# EAGLE design 1P3W (EAGLE 9.6.2)
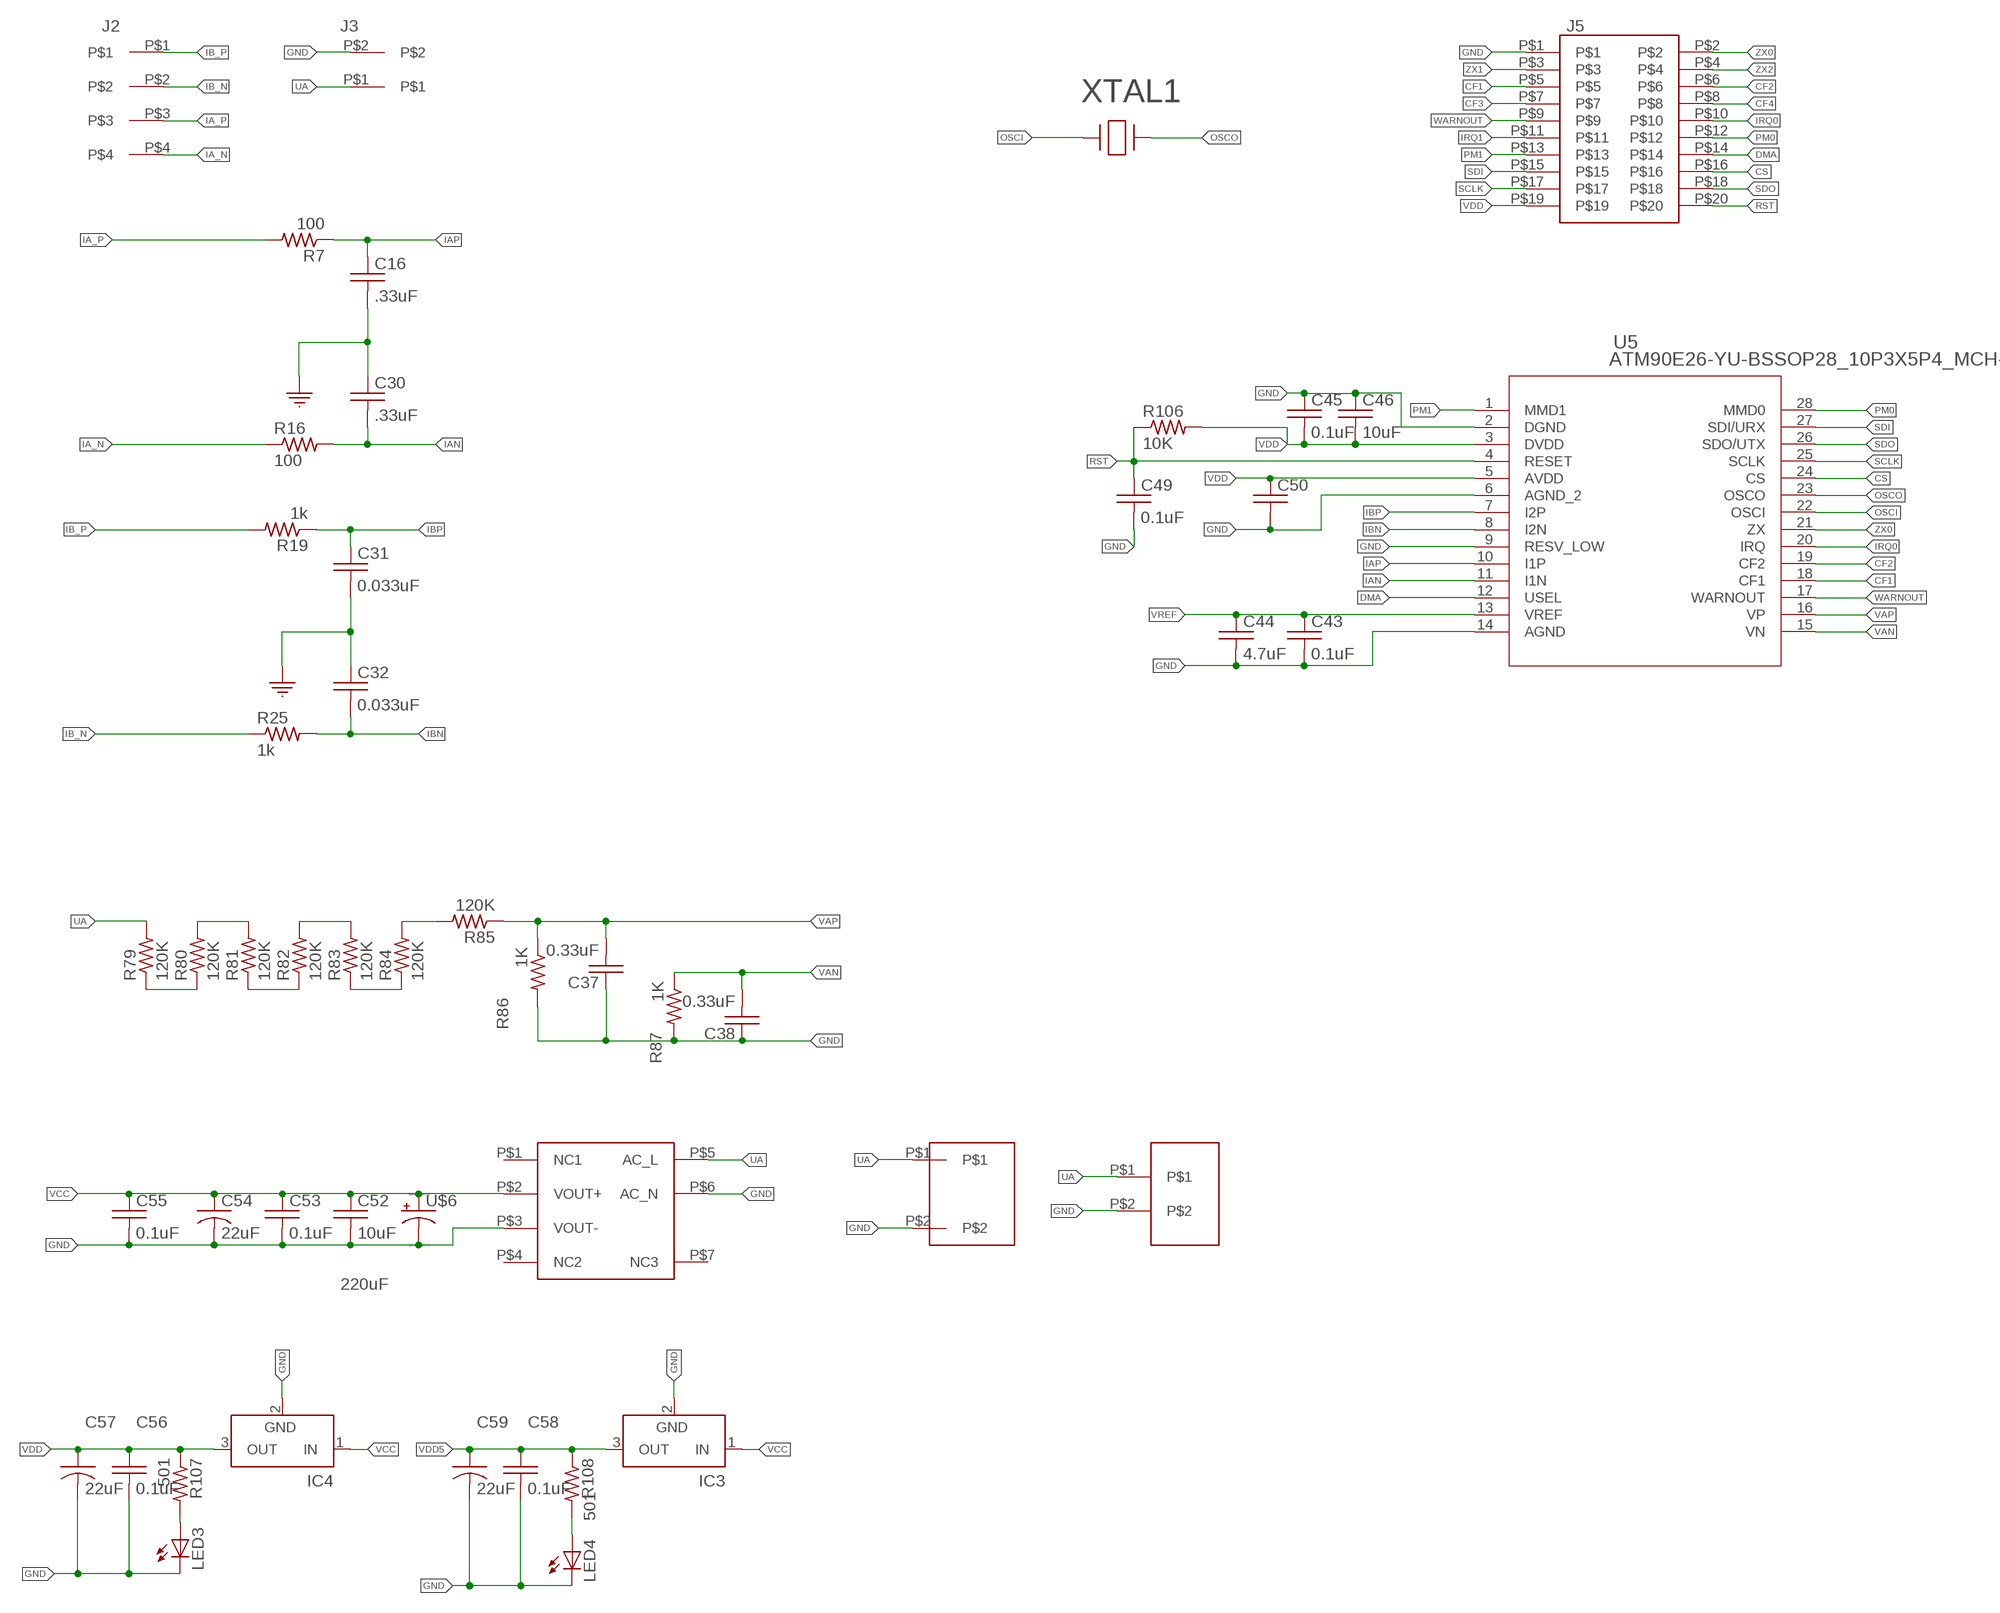
[diagram p0: schematic, sheet 1]

## Parts
C16  .33uF  C_0402  [0402]
C30  .33uF  C_0402  [0402]
C31  0.033uF  C_0402  [0402]
C32  0.033uF  C_0402  [0402]
C37  0.33uF  C_0402  [0402]
C38  0.33uF  C_0402  [0402]
C43  0.1uF  C_0402  [0402]
C44  4.7uF  C_0402  [0402]
C45  0.1uF  C_0402  [0402]
C46  10uF  C_0402  [0402]
C49  0.1uF  C_0402  [0402]
C50  C_0402  [0402]
C51  CAP_THIN_FILM_TDK_32922CAP  [CAP_THIN_FILM_32922]
C52  10uF  C_0402  [0402]
C53  0.1uF  C_0402  [0402]
C54  22uF  C-USC1206  [C1206]
C55  0.1uF  C_0402  [0402]
C56  0.1uF  C_0402  [0402]
C57  22uF  C-USC1206  [C1206]
C58  0.1uF  C_0402  [0402]
C59  22uF  C-USC1206  [C1206]
IC3  LT1129CST5  [SOT223]
IC4  LT1129CST3  [SOT223]
J2  3.81MM_1_X_4_RT_ANGLE_PLUG_HEADER  [1X4_3.81MM_PITCH]
J3  3.81MM_1_X_2_RT_ANGLE_PLUG_HEADER  [2_3.81MM_PITCH]
J5  2_X_10_HEADER_GENERIC  [2_X_10_.1_INCH]
LED3  LED_0805_GREEN  [LED_0805_GREEN]
LED4  LED_0805_GREEN  [LED_0805_GREEN]
R7  100  R_0402  [0402]
R16  100  R_0402  [0402]
R19  1k  R_0402  [0402]
R25  1k  R_0402  [0402]
R79  120K  R_0402  [0402]
R80  120K  R_0402  [0402]
R81  120K  R_0402  [0402]
R82  120K  R_0402  [0402]
R83  120K  R_0402  [0402]
R84  120K  R_0402  [0402]
R85  120K  R_0402  [0402]
R86  1K  R_0402  [0402]
R87  1K  R_0402  [0402]
R106  10K  R_0402  [0402]
R107  501  R_0402  [0402]
R108  501  R_0402  [0402]
U4  TMLM_04109  [TMLM04]
U5  ATM90E26-YU-BSSOP28_10P3X5P4_MCH-M  [SSOP28_10P3X5P4_MCH-M]
U$5  VAR_10MM_VDRUS10  [VAR_10MM_VDRUS10]
U$6  220uF  C_AL_ELECTROLYTIC_SMD_220UF  [C_AL_ELECTROLYTIC_SMD_220UF]
XTAL1  ABLS-8.192MHZ-B2-TXTAL_HC/49US_ABLS_ABR-M  [XTAL_HC/49US_ABLS_ABR-M]

## Nets
CF1: J5.P$5 U5.18(CF1)
CF2: J5.P$6 U5.19(CF2)
CF3: J5.P$7
CF4: J5.P$8
CS: J5.P$16 U5.24(CS)
DMA: J5.P$14 U5.12(USEL)
GND: C16.P$2 C30.P$1 C31.P$2 C32.P$1 C37.P$1 C38.P$1 C43.P$2 C44.P$2 C45.P$1 C46.P$1 C49.P$2 C50.P$2 C51.P$2 C52.P$2 C53.P$2 C54.2 C55.P$2 C56.P$2 C57.2 C58.P$2 C59.2 IC3.2(GND) IC4.2(GND) J3.P$2 J5.P$1 LED3.C LED4.C R86.P$2 R87.P$2 U4.P$3(VOUT-) U4.P$6(AC_N) U5.2(DGND) U5.6(AGND_2) U5.9(RESV_LOW) U5.14(AGND) U$5.P$2 U$6.N-(-)
IA_N: J2.P$4 R16.P$1
IA_P: J2.P$3 R7.P$2
IAN: C30.P$2 R16.P$2 U5.11(I1N)
IAP: C16.P$1 R7.P$1 U5.10(I1P)
IB_N: J2.P$2 R25.P$1
IB_P: J2.P$1 R19.P$2
IBN: C32.P$2 R25.P$2 U5.8(I2N)
IBP: C31.P$1 R19.P$1 U5.7(I2P)
IRQ0: J5.P$10 U5.20(IRQ)
IRQ1: J5.P$11
N$37: R79.P$1 R80.P$1
N$38: R80.P$2 R81.P$2
N$39: R81.P$1 R82.P$1
N$40: R82.P$2 R83.P$2
N$41: R83.P$1 R84.P$1
N$42: R84.P$2 R85.P$2
N$55: LED3.A R107.P$2
N$56: LED4.A R108.P$2
OSCI: U5.22(OSCI) XTAL1.1
OSCO: U5.23(OSCO) XTAL1.2
PM0: J5.P$12 U5.28(MMD0)
PM1: J5.P$13 U5.1(MMD1)
RST: C49.P$1 J5.P$20 R106.P$1 U5.4(RESET)
SCLK: J5.P$17 U5.25(SCLK)
SDI: J5.P$15 U5.27(SDI/URX)
SDO: J5.P$18 U5.26(SDO/UTX)
UA: C51.P$1 J3.P$1 R79.P$2 U4.P$5(AC_L) U$5.P$1
VAN: C38.P$2 R87.P$1 U5.15(VN)
VAP: C37.P$2 R85.P$1 R86.P$1 U5.16(VP)
VCC: C52.P$1 C53.P$1 C54.1 C55.P$1 IC3.1(IN) IC4.1(IN) U4.P$2(VOUT+) U$6.P+(+)
VDD: C45.P$2 C46.P$2 C50.P$1 C56.P$1 C57.1 IC4.3(OUT) J5.P$19 R106.P$2 R107.P$1 U5.3(DVDD) U5.5(AVDD)
VDD5: C58.P$1 C59.1 IC3.3(OUT) R108.P$1
VREF: C43.P$1 C44.P$1 U5.13(VREF)
WARNOUT: J5.P$9 U5.17(WARNOUT)
ZX0: J5.P$2 U5.21(ZX)
ZX1: J5.P$3
ZX2: J5.P$4
Unconnected: U4.P$1(NC1) U4.P$4(NC2) U4.P$7(NC3)

## Power pins joined to a net without a drawn wire
GND: IC3.4(GND) IC4.4(GND)

## Library data of the parts
C16 C30-C32 C37 C38 C43-C46 C49 C50 C52 C53 C55 C56 C58 = 3D_MIG_Controller:C_0402
C51 = 3D_MIG_Controller:CAP_THIN_FILM_TDK_32922
C54 C57 C59 = 3D_MIG_Controller:C-US: CAPACITOR, American symbol
IC3 = 3D_MIG_Controller:LT1129CST5: VOLTAGE REGULATOR with shutdown; MPN: LT1129CST-5#PBF; OC_FARNELL: 1663375; OC_NEWARK: 57M2069
IC4 = 3D_MIG_Controller:LT1129CST3: VOLTAGE REGULATOR with shutdown; MPN: LT1129CST-5#PBF; OC_FARNELL: 1663375; OC_NEWARK: 57M2069
J2 = 3D_MIG_Controller:3.81MM_1_X_4_RT_ANGLE_PLUG_HEADER
J3 = 3D_MIG_Controller:3.81MM_1_X_2_RT_ANGLE_PLUG_HEADER
J5 = 3D_MIG_Controller:2_X_10_HEADER_GENERIC
LED3 LED4 = 3D_MIG_Controller:LED_0805_GREEN
R7 R16 R19 R25 R79-R87 R106-R108 = 3D_MIG_Controller:R_0402
U4 = 3D_MIG_Controller:TMLM_04109
U5 = 3D_MIG_Controller:ATM90E26-YU-B; BUILT_BY: EMA_Molly; COPYRIGHT: Copyright (C) 2018 Accelerated Designs. All rights reserved; MANUFACTURER_PART_NUMBER: ATM90E26-YU-B; SOURCELIBRARY: Microchip_2019-08-23_24; VENDOR: Microchip
U$5 = 3D_MIG_Controller:VAR_10MM_VDRUS10
U$6 = 3D_MIG_Controller:C_AL_ELECTROLYTIC_SMD_220UF
XTAL1 = 3D_MIG_Controller:ABLS-8.192MHZ-B2-T; BUILT_BY: EMA_Cory; COPYRIGHT: Copyright (C) 2018 Accelerated Designs. All rights reserved; DATASHEET: https://abracon.com/Resonators/abls.pdf; MANUFACTURER_PART_NUMBER: ABLS-8.192MHZ-B2-T; SOURCELIBRARY: Abracon_2020-04-08; VENDOR: Abracon

## Board
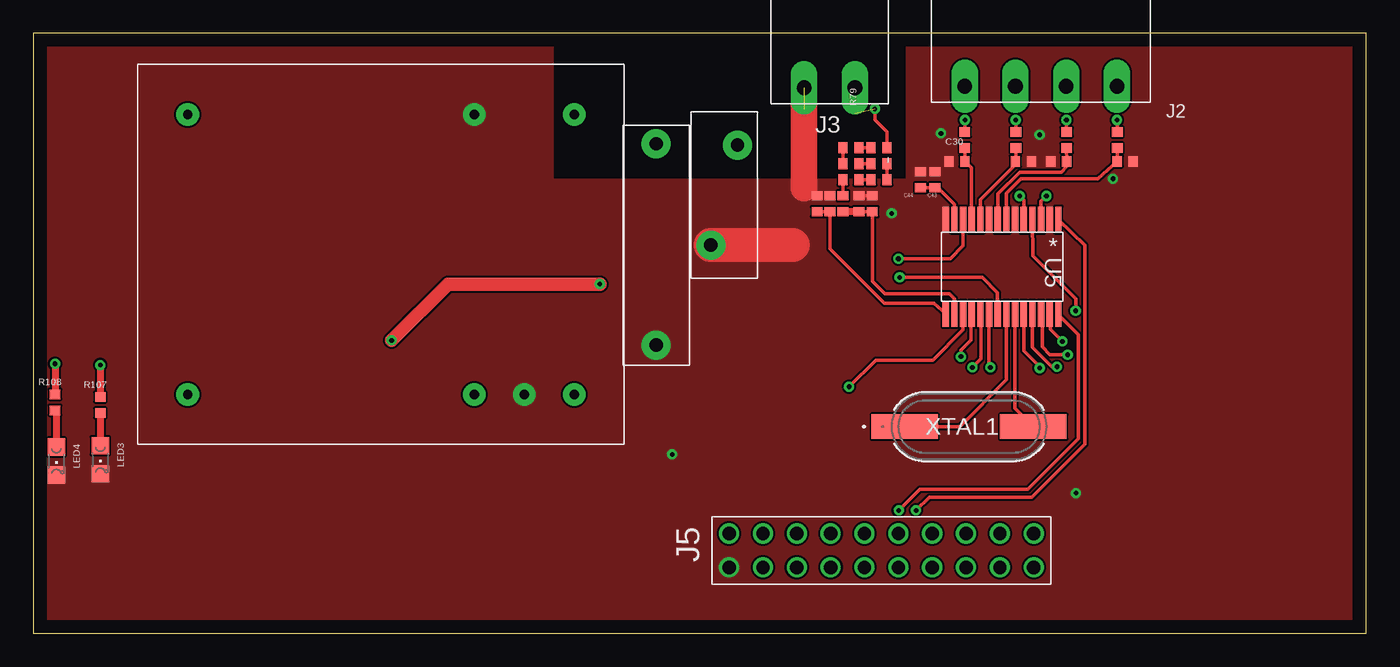
[diagram p1: board, top side]
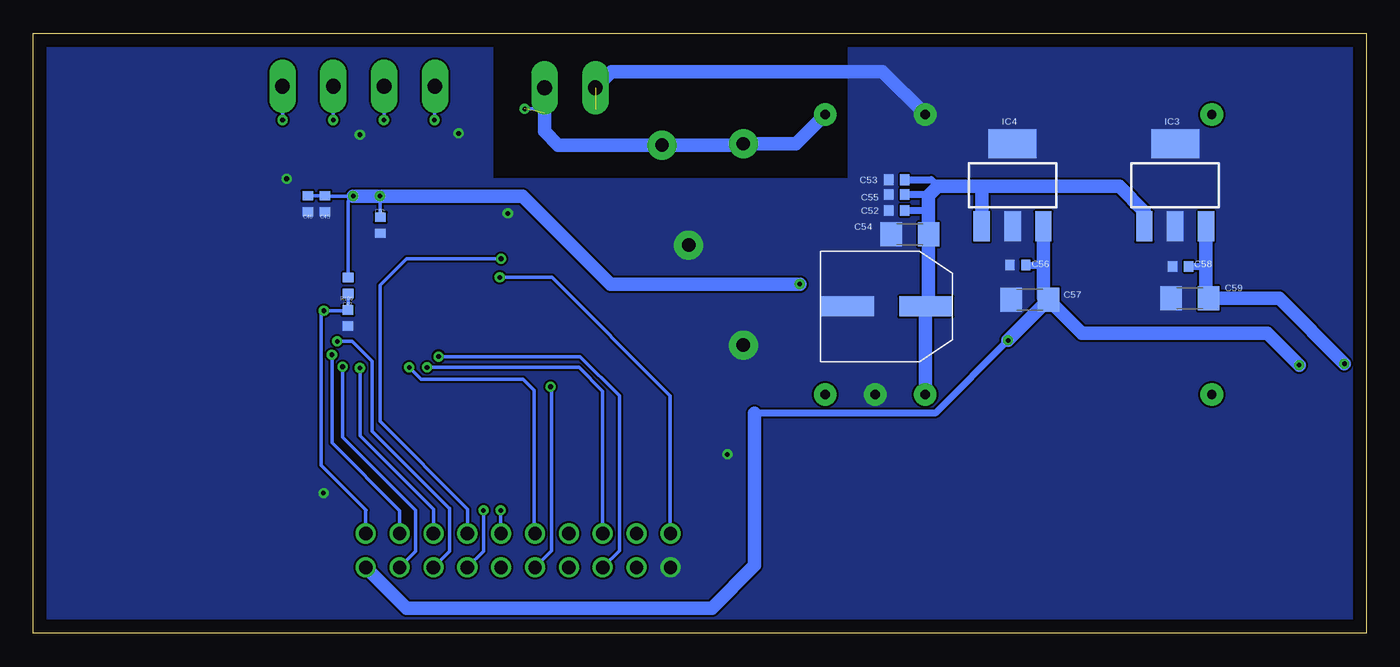
[diagram p2: board, bottom side, seen from below]

Size 100 x 45 mm. Coordinates in mm from the lower left corner, seen from the top.
Outline: 0,0 100,0 100,45 0,45 0,0
Copper layers (1*16): Top 0.035mm / dielectric 1.5mm / Bottom 0.035mm
Design rules "default": minimum track width 6mil, minimum drill 0.35mm, track to track 6mil, track to pad 6mil, pad to pad 6mil, via to via 6mil, smd to smd 6mil, copper to edge 40mil, drill to drill 6mil, minimum pad ring 10mil, minimum via ring 8mil, stop-mask expansion 4mil, vias tented up to drill 0mil, thermal gap 10mil

### Footprints (pad centres in the part's own frame; a part is rotated, then mirrored left to right if it is on the bottom)
0402 = smd 0.8 x 0.7: P$1 0,0.6; P$2 0,-0.6
CAP_THIN_FILM_32922 = drill 1 pad 2.184: P$1 -0.1,0; P$2 15,0
C1206 = smd 1.6 x 1.8: 1 -1.4,0; 2 1.4,0
SOT223 = smd 1.219 x 2.235: 1 -2.311,-3.099; 2 0,-3.099; 3 2.311,-3.099 | smd 3.6 x 2.2: 4 0,3.099
1X4_3.81MM_PITCH = drill 1.1 pad 2 long: P$1 0,0; P$2 3.81,0; P$3 7.62,0; P$4 11.43,0
2_3.81MM_PITCH = drill 1.1 pad 2 long: P$1 0,0; P$2 3.81,0
2_X_10_.1_INCH = drill 1: P$1 -11.43,-1.27; P$2 -11.43,1.27; P$3 -8.89,-1.27; P$4 -8.89,1.27; P$5 -6.35,-1.27; P$6 -6.35,1.27; P$7 -3.81,-1.27; P$8 -3.81,1.27; P$9 -1.27,-1.27; P$10 -1.27,1.27; P$11 1.27,-1.27; P$12 1.27,1.27; P$13 3.81,-1.27; P$14 3.81,1.27; P$15 6.35,-1.27; P$16 6.35,1.27; P$17 8.89,-1.27; P$18 8.89,1.27; P$19 11.43,-1.27; P$20 11.43,1.27
LED_0805_GREEN = smd 1.3 x 1.3: A 0,-1.05; C 0,1.05
TMLM04 = drill 0.7 pad 1.7: P$1 21,-25.25; P$2 21,-3.75; P$3 21,0; P$4 21,3.75; P$5 0,3.75; P$6 0,-3.75; P$7 0,-25.25
SSOP28_10P3X5P4_MCH-M = smd 1.956 x 0.483: 1 -3.531,4.225; 2 -3.531,3.575; 3 -3.531,2.925; 4 -3.531,2.275; 5 -3.531,1.625; 6 -3.531,0.975; 7 -3.531,0.325; 8 -3.531,-0.325; 9 -3.531,-0.975; 10 -3.531,-1.625; 11 -3.531,-2.275; 12 -3.531,-2.925; 13 -3.531,-3.575; 14 -3.531,-4.225; 15 3.531,-4.225; 16 3.531,-3.575; 17 3.531,-2.925; 18 3.531,-2.275; 19 3.531,-1.625; 20 3.531,-0.975; 21 3.531,-0.325; 22 3.531,0.325; 23 3.531,0.975; 24 3.531,1.625; 25 3.531,2.275; 26 3.531,2.925; 27 3.531,3.575; 28 3.531,4.225
VAR_10MM_VDRUS10 = drill 1 pad 2.184: P$1 0,1; P$2 7.5,-1
C_AL_ELECTROLYTIC_SMD_220UF = smd 1.5 x 4: N- 0,2; P+ 0,7.9
XTAL_HC/49US_ABLS_ABR-M = smd 4.978 x 1.829: 1 -4.826,0; 2 4.826,0

### Placement (x,y rotation side)
C16  74.29,35.4 90 top
C30  69.3,35.4 90 top
C31  81.92,35.4 90 top
C32  76.92,35.4 90 top
C37  62.94,32.22 0 top
C38  58.81,32.22 0 top
C43  67.64,34.02 180 top
C44  66.56,34.02 180 top
C45  78.13,32.22 180 bottom
C46  79.41,32.22 180 bottom
C49  76.4,23.64 0 bottom
C50  73.97,30.6 0 bottom
C51  46.73,36.62 270 top
C52  35.23,31.72 270 bottom
C53  35.23,34.02 270 bottom
C54  34.23,29.92 180 bottom
C55  35.23,32.92 270 bottom
C56  26.13,27.62 270 bottom
C57  25.23,25.02 180 bottom
C58  13.93,27.52 270 bottom
C59  13.23,25.12 180 bottom
IC3  14.33,33.62 0 bottom
IC4  26.53,33.62 0 bottom
J2  81.31,41.03 180 top
J3  61.64,40.92 180 top
J5  63.63,6.22 0 top
LED3  5.03,13.02 180 top
LED4  1.73,12.92 180 top
R7  73.72,37 180 top
R16  69.89,37 0 top
R19  81.33,37 180 top
R25  77.52,37 0 top
R79  63.44,36.42 90 top
R80  61.34,36.42 270 top
R81  61.34,35.22 270 top
R82  63.44,35.22 90 top
R83  63.44,34.02 90 top
R84  61.34,34.02 270 top
R85  60.74,32.22 180 top
R86  61.94,32.22 180 top
R87  59.77,32.22 180 top
R106  76.38,26.09 180 bottom
R107  5.03,17.12 0 top
R108  1.63,17.32 0 top
U4  36.83,38.92 270 top
U5  72.68,27.49 270 top
U$5  51.83,36.62 270 top
U$6  40.93,24.52 270 bottom
XTAL1  70.2,15.5 0 top

### Tracks (layer width: path | path; a pad name or v marks a point on that pad's centre or on a via)
CF1  (via drill 0.35)
  Top 0.254: v69.6,20.76 69.6,21.23 70.36,21.98 70.36,23.91 U5.18
  Bottom 0.254: J5.P$5 56.03,6.2 56.03,17.82 58.97,20.76 v69.6,20.76
CF2  (via drill 0.35)
  Top 0.254: U5.19 71.09,23.93 71.09,20.59 v70.45,19.95
  Bottom 0.254: v70.45,19.95 59.06,19.95 57.28,18.17 J5.P$6
CF4
  Bottom 0.254: J5.P$8
CS  (via drill 0.35)
  Top 0.254: v75.5,19.9 75.5,20 74.31,21.2 U5.24
  Bottom 0.254: J5.P$16 69.98,9.3 75.5,14.82 v75.5,19.9
DMA  (via drill 0.35)
  Top 0.254: v64.9,28.1 68.8,28.1 69.75,29.05 U5.12
  Bottom 0.254: J5.P$14 67.43,9.22 67.43,9.32 74,15.89 74,26.1 72,28.1 v64.9,28.1
GND  (via drill 0.35)  (1 unrouted)
  Top 0.254: R86.P$2 C37.P$1 | 58.04,39.1 57.83,39.31
  Top 2: J3.P$2 57.83,33.39
  Top 2.54: 56.99,29.12 U$5.P$2
  Bottom 1.016: U4.P$6 36.28,42.12 56.63,42.12 J3.P$2
  other vias: 78.23,10.52 47.93,13.42 64.4,31.5 68.1,37.5 75.5,37.4 81,34.1
  pour Top (no thermals): 0,45 39,45 39,34.1 65.5,34.1 65.5,45 100,45 100,0 0,0
  pour Bottom (no thermals): 0,45 38.9,45 38.9,34.1 65.5,34.1 65.5,45 100,45 100,0 0,0
IA_N  (via drill 0.35)
  Top 0.254: R16.P$1 69.89,38.59 v69.9,38.5
  Bottom 0.254: v69.9,38.5 69.9,41.01 J2.P$4
IA_P  (via drill 0.35)
  Top 0.254: R7.P$2 73.72,38.48 v73.7,38.5
  Bottom 0.254: v73.7,38.5 J2.P$3
IAN
  Top 0.254: R16.P$2 69.89,35.31 C30.P$2 69.91,35.4 70.4,34.91 U5.11
IAP
  Top 0.254: R7.P$1 73.72,35.66 C16.P$1 73.69,35.15 71.06,32.52 U5.10
IB_N  (via drill 0.35)
  Top 0.254: R25.P$1 77.52,38.58 v77.5,38.5
  Bottom 0.254: v77.5,38.5 J2.P$2
IB_P  (via drill 0.35)
  Top 0.254: R19.P$2 81.33,38.47 v81.3,38.5
  Bottom 0.254: v81.3,38.5 J2.P$1
IBN
  Top 0.254: R25.P$2 77.53,35.42 C32.P$2 77.52,35 77.12,34.6 74,34.6 72.35,32.95 U5.8
IBP
  Top 0.254: R19.P$1 81.32,35.61 C31.P$1 79.85,34.09 74.1,34.09 73.01,33 U5.7
IRQ0  (via drill 0.35)
  Top 0.254: U5.20 71.69,20.06 v71.8,19.94
  Bottom 0.254: J5.P$10 62.43,7.56 62.43,18.22 63.25,19.04 70.9,19.04 v71.8,19.94
N$37
  Top 0.254: R80.P$1 R79.P$1
N$38
  Top 0.254: R81.P$2 R80.P$2
N$39
  Top 0.254: R82.P$1 R81.P$1
N$40
  Top 0.254: R83.P$2 R82.P$2
N$41
  Top 0.254: R84.P$1 R83.P$1
N$42
  Top 0.254: R85.P$2 R84.P$2
N$55
  Top 0.508: R107.P$2 LED3.A
N$56
  Top 0.508: R108.P$2 1.73,16.62 LED4.A
OSCI
  Top 0.254: U5.22 73.01,19.01 69.5,15.5 XTAL1.1
OSCO
  Top 0.254: U5.23 73.66,16.87 XTAL1.2
PM0  (via drill 0.35)
  Top 0.254: U5.28 76.97,23.83 78.4,22.4 78.4,14.6 74.62,10.82 66.53,10.82 v64.93,9.22
  Bottom 0.254: v64.93,9.22 64.93,7.52 J5.P$12
PM1  (via drill 0.35)
  Top 0.254: U5.1 78.9,29.09 78.9,14.2 74.92,10.22 67.23,10.22 v66.23,9.22
  Bottom 0.254: v66.23,9.22 66.23,6.16 J5.P$13
RST  (via drill 0.35)
  Top 0.254: v78.2,24.2 78.2,25.1 74.99,28.31 U5.4
  Bottom 0.254: J5.P$20 75.06,9.19 75.03,9.22 78.4,12.59 78.4,24 v78.2,24.2 76.44,24.2 C49.P$1 76.4,25.48 R106.P$1
SCLK  (via drill 0.35)
  Top 0.254: U5.25 74.95,21.45 76.4,20 v76.8,20
  Bottom 0.254: J5.P$17 71.32,6.15 71.32,9.22 76.8,14.7 v76.8,20
SDI  (via drill 0.35)
  Top 0.254: U5.27 76.31,22.79 v77.2,21.9
  Bottom 0.254: J5.P$15 68.78,6.15 68.78,9.37 68.8,9.37 74.59,15.17 74.59,20.39 76.1,21.9 v77.2,21.9
SDO  (via drill 0.35)
  Top 0.254: U5.26 75.69,23.92 75.69,21.48 76.27,20.9 v77.6,20.9
  Bottom 0.254: J5.P$18 72.52,9.2 77.6,14.28 v77.6,20.9
UA  (via drill 0.35)  (1 unrouted)
  Top 0.254: R79.P$2 64.04,37.62 63.13,38.53 v63.13,39.33
  Bottom 0.254: v63.13,39.33 61.64,39.33
  Bottom 1.016: J3.P$1 61.64,39.33 | 61.64,39 61.64,37.64 60.62,36.62 U$5.P$1 46.83,36.62 C51.P$1 42.78,36.72 U4.P$5
VAN
  Top 0.254: C38.P$2 R87.P$1 59.77,28.83 63.84,24.76 67.59,24.76 U5.15
VAP
  Top 0.254: 62.04,31.62 R86.P$1 C37.P$2 62.94,26.42 63.9,25.46 68.75,25.46 69.11,25.1 U5.16
  Top 0.508: 62.04,31.62 R85.P$1
VCC
  Bottom 0.508: C53.P$1 32.63,34.02 32.13,33.52 | C55.P$1 32.93,32.92 32.83,32.82 | C52.P$1 32.93,31.72 32.83,31.82
  Bottom 1.016: U4.P$2 33.08,24.47 U$6.P+ 32.83,24.72 C54.1 32.83,31.82 32.83,32.82 32.13,33.52 28.84,33.52 | 28.84,33.52 IC4.1 | 28.84,33.52 18.53,33.52 16.64,31.63 IC3.1
VDD  (via drill 0.35)
  Top 0.254: 74.31,31.22 U5.5 74.31,32.49 v74,32.8 | U5.3 75.61,32.41 v76,32.8
  Top 0.508: v5.03,20.12 R107.P$1
  Top 1.016: v26.88,21.98 31.1,26.2 v42.5,26.2
  Bottom 0.254: v76,32.8 76.03,32.83 | v74,32.8 73.97,32.77 C50.P$1 | R106.P$2 76.38,32.42 v76,32.8 | v76,32.8 78.11,32.8 C45.P$2 C46.P$2
  Bottom 0.508: C57.1 23.93,24.92 | 23.93,24.92 v26.88,21.98 32.33,16.52 45.9,16.52 | IC4.3 | 24.23,25.22 23.93,24.92 | C56.P$1 24.32,27.62 24.22,27.72
  Bottom 1.016: v5.03,20.12 7.43,22.52 21.33,22.52 C57.1 v26.88,21.98 | IC4.3 24.22,27.72 24.22,25.21 23.93,24.92 | J5.P$19 72.01,1.9 49.1,1.9 45.9,5.1 45.9,16.52 | v42.5,26.2 56.7,26.2 63.3,32.8 v74,32.8 v76,32.8
VDD5  (via drill 0.35)
  Top 0.508: v1.63,20.22 R108.P$1
  Bottom 0.508: 13.42,27.61 C58.P$1 12.12,27.52 12.02,27.62 | 11.93,25.22 C59.1
  Bottom 1.016: 11.78,25.17 C59.1 6.53,25.12 v1.63,20.22 | IC3.3 12.02,27.62 12.02,25.31 11.93,25.22
VREF
  Top 0.254: C43.P$1 | C44.P$1 C43.P$1 | U5.13 69.11,32.2 67.88,33.42 C43.P$1
WARNOUT  (via drill 0.35)
  Top 0.254: v61.2,18.5 63.2,20.5 67.5,20.5 69.75,22.75 U5.17
  Bottom 0.254: J5.P$9 61.13,6.18 61.13,18.5 v61.2,18.5
ZX0  (via drill 0.35)
  Top 0.254: U5.21 72.35,25.55 71.2,26.7 v65,26.7
  Bottom 0.254: J5.P$2 52.23,7.52 52.23,9.22 52.23,17.83 61.1,26.7 v65,26.7
ZX2
  Bottom 0.254: J5.P$4